# Altium schematic sheet LCA_V2_power.SchDoc
size A4; SheetNumber: 2; SheetTotal: 3
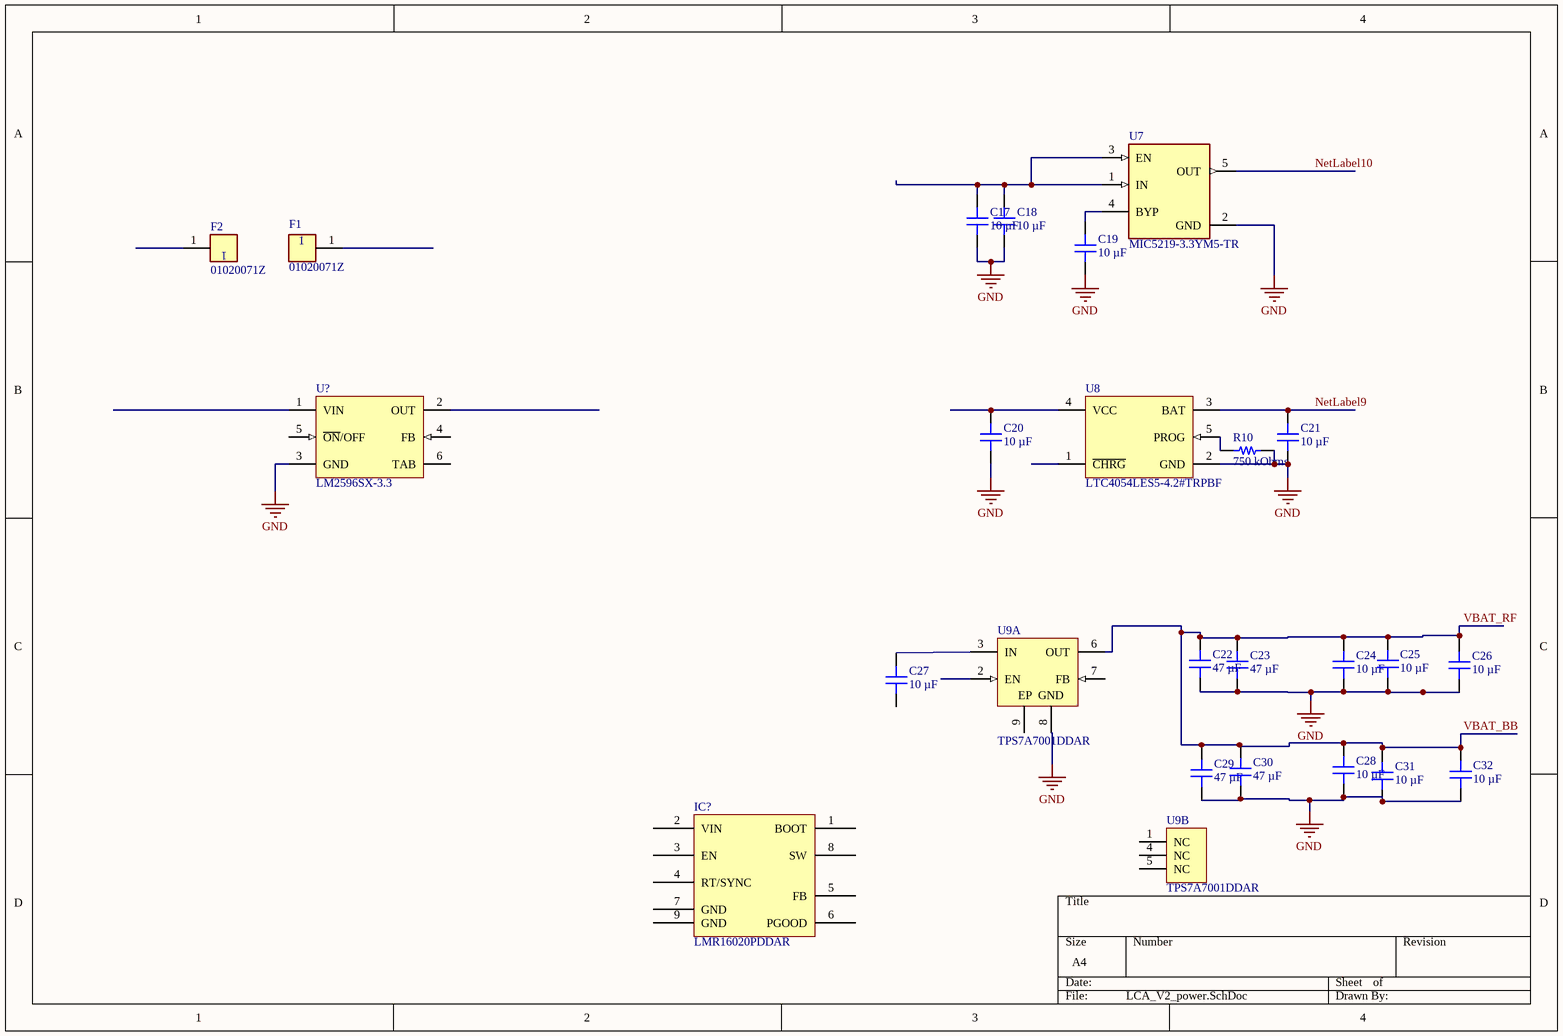
[diagram p0: LCA_V2_power.SchDoc]

## Parts
C17  10 µF  [CAP 0805_2012]
C18  10 µF  [CAP 0805_2012]
C19  10 µF  [CAP 0805_2012]
C20  10 µF  [CAP 0805_2012]
C21  10 µF  [CAP 0805_2012]
C22  47 µF  [CAP 1210_3225 - 1MM]
C23  47 µF  [CAP 1210_3225 - 1MM]
C24  10 µF  [CAP 0805_2012]
C25  10 µF  [CAP 0805_2012]
C26  10 µF  [CAP 0805_2012]
C27  10 µF  [CAP 0805_2012]
C28  10 µF  [CAP 0805_2012]
C29  47 µF  [CAP 1210_3225 - 1MM]
C30  47 µF  [CAP 1210_3225 - 1MM]
C31  10 µF  [CAP 0805_2012]
C32  10 µF  [CAP 0805_2012]
F1  01020071Z  [FP-102-MFG]
F2  01020071Z  [FP-102-MFG]
IC?  LMR16020PDDAR  [TI SOIC-8 DDA0008B]
R10  750 kOhms  [RES 0805_2012]
U7  MIC5219-3.3YM5-TR  [FP-SOT23-5LD-PL-1-IPC_C]
U8  LTC4054LES5-4.2#TRPBF  [LT-S5-5-TSOT-23_L]
U9  TPS7A7001DDAR  [DDA0008E_M]  (parts A,B of 2)
U?  LM2596SX-3.3  [KTT0005B_L]

## Nets
GND: C17.1 C18.1 C19.1 C20.1 C21.1 C22.1 C23.1 C24.1 C25.1 C26.1 C28.1 C29.1 C30.1 C31.1 C32.1 R10.1 U7.2(GND) U8.2(GND) U9.8(GND) U?.3(GND)
NetLabel9: C21.2 U8.3(BAT)
NetLabel10: U7.5(OUT)
VBAT_BB: C22.2 C23.2 C24.2 C25.2 C26.2 C28.2 C29.2 C30.2 C31.2 C32.2 U9.6(OUT)  [also labelled VBAT_RF]
NetC17_2: C17.2 C18.2 U7.1(IN) U7.3(EN)
NetC19_2: C19.2 U7.4(BYP)
NetC20_2: C20.2 U8.4(VCC)
NetC27_2: C27.2 U9.3(IN)
NetR10_2: R10.2 U8.5(PROG)

Not connected (* = marked no-connect by the designer): C27 1; F1 1; F2 1; IC? 1(BOOT) 2(VIN) 3(EN) 4(RT/SYNC) 5(FB) 6(PGOOD) 7(GND) 8(SW) 9(GND); U8 1(~{CHRG}); U9 1(NC) 2(EN) 4(NC) 5(NC) 7(FB) 9(EP); U? 1(VIN) 2(OUT) 4(FB) 5(~{ON}/OFF) 6(TAB)

## Library data of the parts
C17-C21 C24-C28 C31 C32 = CL21A106KQFNFNE: CAP CER 10UF 6.3V X5R 0805; manufacturer: Samsung Electro-Mechanics; Tolerance: ±10%; Part Number: CL21A106KQFNFNE; Value: 10 µF; Applications: General Purpose; Capacitance: 10 µF; componentlink1description: Datasheet; componentlink1url: http://www.samsungsem.com/kr/support/product-search/mlcc/CL21A106KQFNFNE.jsp; componentlink2description: DigiKey Link; componentlink2url: https://www.digikey.com/en/products/detail/samsung-electro-mechanics/CL21A106KQFNFNE/3888556; Device Package: 0805 (2012 Metric); lastupdated: 09-02-2024 20:16:07; Lifecycle Status: Active; Minimum Order: 1; Mounting Type: Surface Mount, MLCC; Operating Temperature: -55°C ~ 85°C; Package / Case: 0805 (2012 Metric); packaging: TapeAndReel; partid: 3259; Part Status: Active; price: 0.01; series: CL; Size / Dimension: 0.079" L x 0.049" W (2.00mm x 1.25mm); Supplier 1: DigiKey; Supplier Part Number 1: 1276-2898-1-ND; Temperature Coefficient: X5R; Thickness (Max): 0.053" (1.35mm); Voltage - Rated: 6.3V
C22 C23 C29 C30 = GRM32EC81C476KE15L: CAP CER 47UF 16V X6S 1210; manufacturer: Murata Electronics; Tolerance: ±10%; Part Number: GRM32EC81C476KE15L; Value: 47 µF; Applications: General Purpose; Capacitance: 47 µF; componentlink1description: Datasheet; componentlink1url: https://search.murata.co.jp/Ceramy/image/img/A01X/G101/ENG/GRM32EC81C476KE15-01.pdf; componentlink2description: DigiKey Link; componentlink2url: https://www.digikey.com/en/products/detail/murata-electronics/GRM32EC81C476KE15L/5027615; Device Package: 1210 (3225 Metric); lastupdated: 09-02-2024 20:44:56; Lifecycle Status: Active; Minimum Order: 1; Mounting Type: Surface Mount, MLCC; Operating Temperature: -55°C ~ 105°C; Package / Case: 1210 (3225 Metric); packaging: TapeAndReel; partid: 23627; Part Status: Active; price: 0.10; series: GRM; Size / Dimension: 0.126" L x 0.098" W (3.20mm x 2.50mm); Supplier 1: DigiKey; Supplier Part Number 1: 490-10531-1-ND; Temperature Coefficient: X6S; Thickness (Max): 0.106" (2.70mm); Voltage - Rated: 16V
F1 F2 = CMP-08604-000017-1: FUSE CLIP CARTRIDGE 250V 15A PCB; Manufacturer: Littelfuse Inc; Is Female: yes; Number Of Fuses: 1; Conn Orientation: Vertical; ComponentLink2Description: Datasheet; Mouser Description: Fuse Clips ACS 3AG PC CLIP; RoHS: TRUE; Package: 102; Category: Fuse; Voltage Rating Dc: 250V; Digikey Description: FUSE CLIP CARTRIDGE 250V 15A PCB; Automotive: No; Device Class L1: Circuit Protection; Octopart: https://octopart.com/01020071z-littelfuse-18837869; Device Class L2: Fuse Holders; Height: 10.67mm; Manufacturer Part Number: 01020071Z; Voltage Rating Ac: 250V; ComponentLink2URL: https://www.littelfuse.com/~/media/electronics/datasheets/fuse_clips/littelfuse_fuse_clip_102_122_datasheet.pdf.pdf; Fuse Current: 15A; Device Class L3: unset; Lead Free: Yes
IC? = LMR16020PDDAR: IC REG BUCK ADJUSTABLE 2A 8SOPWR; Manufacturer: Texas Instruments; Frequency - Switching: 200kHz ~ 2.5MHz; Function: Step-Down; Number of Outputs: 1; Output Configuration: Positive; Synchronous Rectifier: No; Voltage - Input (Max): 60V; Voltage - Input (Min): 4.3V; Voltage - Output (Max): 50V; Voltage - Output (Min/Fixed): 0.8V; Part Number: LMR16020PDDAR; ComponentLink1Description: Datasheet; ComponentLink1URL: http://www.ti.com/general/docs/suppproductinfo.tsp?distId=10&gotoUrl=http%3A%2F%2Fwww.ti.com%2Flit%2Fgpn%2Flmr16020; ComponentLink2Description: DigiKey Link; ComponentLink2URL: https://www.digikey.com/en/products/detail/texas-instruments/LMR16020PDDAR/6098064; Current - Output: 2A; LastUpdated: 31-05-2023 18:37:20; Lifecycle Status: Active; Minimum Order: 1; Mounting Type: Surface Mount; Operating Temperature: -40°C ~ 125°C (TJ); Output Type: Adjustable; Package / Case: 8-PowerSOIC (0.154", 3.90mm Width); Packaging: TapeAndReel; Part Status: Active; Price: 1.87; Series: SIMPLE SWITCHER®; Supplier 1: DigiKey; Supplier Part Number 1: 296-47335-1-ND; Supplier Device Package: 8-SO PowerPad; Topology: Buck
R10 = RMCF0805FT750K: RES 750K OHM 1% 1/8W 0805; Manufacturer: Stackpole Electronics Inc; Power (Watts): 0.125W, 1/8W; Temperature Coefficient: ±100ppm/°C; Part Number: RMCF0805FT750K; Value: 750 kOhms; ComponentLink1Description: Datasheet; ComponentLink1URL: https://www.seielect.com/catalog/sei-rmcf_rmcp.pdf; ComponentLink2Description: DigiKey Link; ComponentLink2URL: https://www.digikey.com/en/products/detail/stackpole-electronics-inc/RMCF0805FT750K/1760532; Composition: Thick Film; Device Package: 0805 (2012 Metric); Features: Automotive AEC-Q200; Height - Seated (Max): 0.026" (0.65mm); LastUpdated: 08-02-2024 21:02:38; Lifecycle Status: Active; Minimum Order: 1; Number of Terminations: 2; Operating Temperature: -55°C ~ 155°C; Package / Case: 0805 (2012 Metric); Packaging: CutTape; PartId: 27859; Part Status: Active; Price: 0.01; Ratings: AEC-Q200; Resistance: 750 kOhms; Series: RMCF; Size / Dimension: 0.079" L x 0.049" W (2.00mm x 1.25mm); Supplier 1: DigiKey; Supplier Part Number 1: RMCF0805FT750KCT-ND; Supplier Device Package: 0805; Tolerance: ±1%
U7 = CMP-06324-000027-1: IC REG LINEAR 3.3V 500MA SOT23-5; Dropout Voltage: 350mV; Output Type: Fixed; Number of Regulators: 1; Max Input Voltage: 12V; Min Input Voltage: 2.5V; Min Operating Temperature: -40°C; Nominal Output Voltage: 3.3V; Output Voltage: 3.3V; Packaging: Cut Tape; Mount: Surface Mount; Number of Pins: 5; Case/Package: SOT-23-5; Lead Free: Lead Free; Max Operating Temperature: 125°C; REACH SVHC: No SVHC; Output Current: 500mA
U8 = CMP-0471-00439-1: 150 mA Standalone Linear Li-Ion Battery Charger, 4.25 to 6.5 V Vin, 5-pin SOT23 (S5-5), -40 to 85 degC, Pb-Free, Tape and Reel; Manufacturer: Linear Technology; Float Voltage: 4.2 V; Vin Min(V): 4.25; Max Charge Current(A): 0.15; Battery Chemistry: Li-Ion, Li-Polymer; Charge Termination: C/10; Number of Cells: 1; Vin Max(V): 6.5; ComponentLink1URL: http://www.linear.com/; ComponentLink1Description: Manufacturer URL; PackageReference: S5-5; Mounting Technology: Surface Mount; PartNumber: LTC4054LES5-4.2#TRPBF; Type of Charger: Linear; PackageDescription: 5-Pin Plastic TSOT-23, Body 1.63 x 2.90 mm, Pitch 0.95 mm; ComponentLink3Description: Package Specification; DatasheetVersion: Rev. A; RoHS: TRUE; ComponentLink3URL: http://cds.linear.com/docs/en/packaging/SOT_5_05-08-1635.pdf; Packing: Tape and Reel; ComponentLink2URL: http://cds.linear.com/docs/en/datasheet/4054l42fa.pdf; PackageVersion: Jun-10; ComponentLink2Description: Datasheet; Code_JEDEC: MO-193
U9 = CMP-0395-00550-2: Single Output Very Low Input LDO, 2 A, Adjustable 0.9 to 5 V Output, 1.5 to 6.5 V Input, 8-pin SOPowerPAD (DDA), -40 to 125 degC, Green (RoHS & no Sb/Br); Manufacturer: Texas Instruments; Iq(Typ)(mA): 0.01; Vin(Max)(V): 6.5; Accuracy(%): 2; Vin(Min)(V): 1.5; Vout Adj(Max)(V): 5; Vout Adj(Min)(V): 0.9; SubFamily: Single Channel LDO; Vdo(Typ)(mV): 170; PartNumber: TPS7A7001DDAR; Mounting Technology: Surface Mount; ComponentLink3Description: Package Specification; ComponentLink2Description: Datasheet; DatasheetVersion: SBVS134B; PackageReference: DDA0008E; PackageVersion: 4202561/F; ComponentLink1Description: Manufacturer URL; Eco-Plan: Green (RoHS & no Sb/Br); Iout(Max)(A): 2; Code_JEDEC: MS-012; ComponentLink1URL: http://www.ti.com/; ComponentLink3URL: http://www.ti.com/litv/pdf/mpds092e; PackageDescription: 8-Pin Plastic Small Outline, Body 3.9 x 4.9 mm, Pitch 1.27 mm; ComponentLink2URL: http://www.ti.com/general/docs/lit/getliterature.tsp?genericPartNumber=TPS7A7001&fileType=pdf
U? = CMP-0069-00283-3: SIMPLE SWITCHER® Power Converter 150 KHz 3A Step-Down Voltage Regulator, 5-pin TO-263; Manufacturer: Texas Instruments; PowerWise: N; PackageTopMarking: NSUZXYTTE#*LM2596S*-3.3 P+; ComponentLink1Description: Datasheet URL; ComponentLink1URL: http://www.ti.com/general/docs/lit/getliterature.tsp?genericPartNumber=LM2596&fileType=pdf; PackageDescription: TO-263, Molded, .400 x .390 x .180in, 5 Lead, .067in Pitch, Surface Mount; PinCount: 5; PackageReference: KTT0005B; RoHS: N; Code_JEDEC: MO-169-AB; CompType: Switcher